# EAGLE schematic sch (EAGLE 8.2.2)
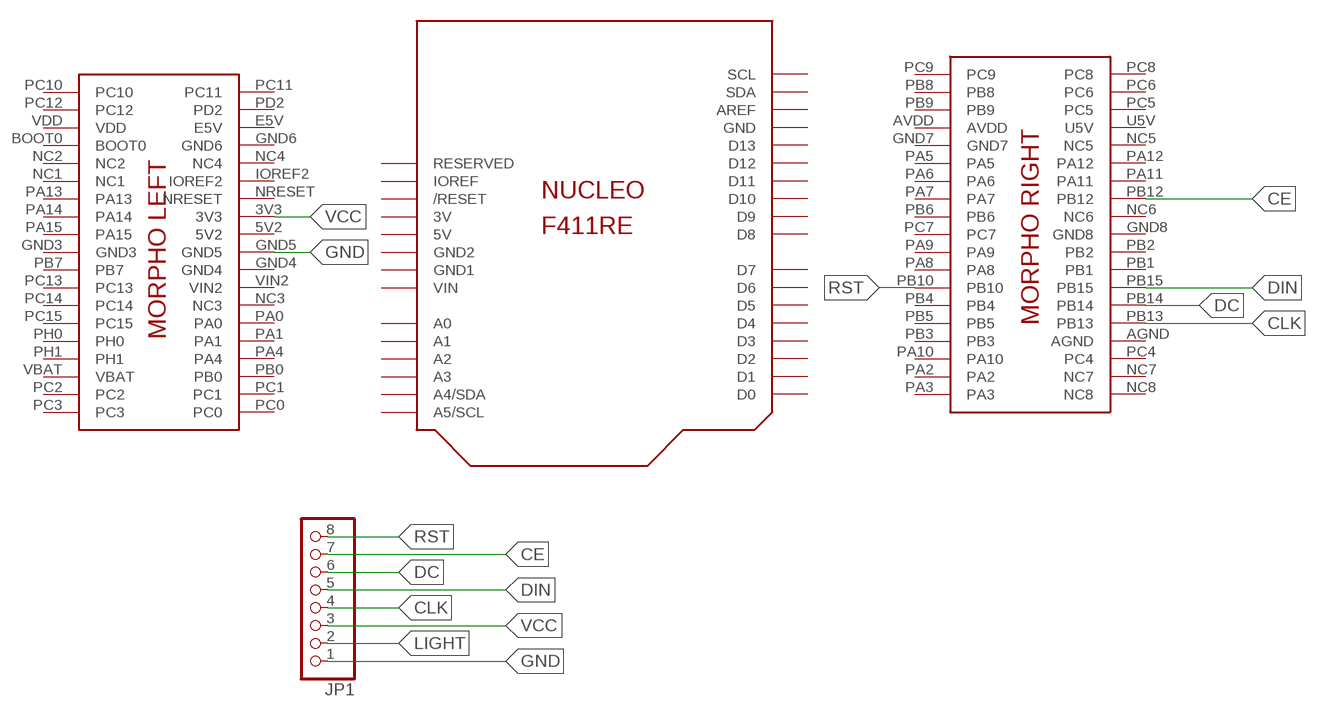
[diagram p0: schematic, sheet 1]

## Parts
JP1  PINHD-1X8-3.5MM  [1X08-3.5MM]
U$1  NUCLEO_F411RE  [NUCLEO_BRD64]

## Nets
CE: U$1.PB12
CLK: U$1.PB13
DC: U$1.PB14
DIN: U$1.PB15
GND: U$1.GND5
LIGHT: JP1.2
RST: U$1.PB10
VCC: U$1.3V3
Unconnected: JP1.1 JP1.3 JP1.4 JP1.5 JP1.6 JP1.7 JP1.8 U$1.A0 U$1.A1 U$1.A2 U$1.A3 U$1.A4(A4/SDA) U$1.A5(A5/SCL) U$1.AREF U$1.BOOT0 U$1.D0 U$1.D1 U$1.D2 U$1.D3 U$1.D4 U$1.D5 U$1.D6 U$1.D7 U$1.D8 U$1.D9 U$1.D10 U$1.D11 U$1.D12 U$1.D13 U$1.IOREF U$1.IOREF2 U$1.NC1 U$1.NC2 U$1.NC3 U$1.NC4 U$1.NC5 U$1.NC6 U$1.NC7 U$1.NC8 U$1.NRESET U$1.PA0 U$1.PA1 U$1.PA2 U$1.PA3 U$1.PA4 U$1.PA5 U$1.PA6 U$1.PA7 U$1.PA8 U$1.PA9 U$1.PA10 U$1.PA11 U$1.PA12 U$1.PA13 U$1.PA14 U$1.PA15 U$1.PB0 U$1.PB1 U$1.PB2 U$1.PB3 U$1.PB4 U$1.PB5 U$1.PB6 U$1.PB7 U$1.PB8 U$1.PB9 U$1.PC0 U$1.PC1 U$1.PC2 U$1.PC3 U$1.PC4 U$1.PC5 U$1.PC6 U$1.PC7 U$1.PC8 U$1.PC9 U$1.PC10 U$1.PC11 U$1.PC12 U$1.PC13 U$1.PC14 U$1.PC15 U$1.PD2 U$1.PH0 U$1.PH1 U$1.RESERVED U$1.RESET(/RESET) U$1.SCL U$1.SDA

## Power pins joined to a net without a drawn wire
3V: U$1.3V
5V: U$1.5V
5V2: U$1.5V2
AGND: U$1.AGND
AVDD: U$1.AVDD
E5V: U$1.E5V
GND: U$1.GND
GND1: U$1.GND1
GND2: U$1.GND2
GND3: U$1.GND3
GND4: U$1.GND4
GND6: U$1.GND6
GND7: U$1.GND7
GND8: U$1.GND8
U5V: U$1.U5V
VBAT: U$1.VBAT
VDD: U$1.VDD
VIN: U$1.VIN
VIN2: U$1.VIN2

## Library data of the parts
JP1 = adafruit:PINHD-1X8: PIN HEADER
U$1 = Stm32nucleo:NUCLEO_F411RE